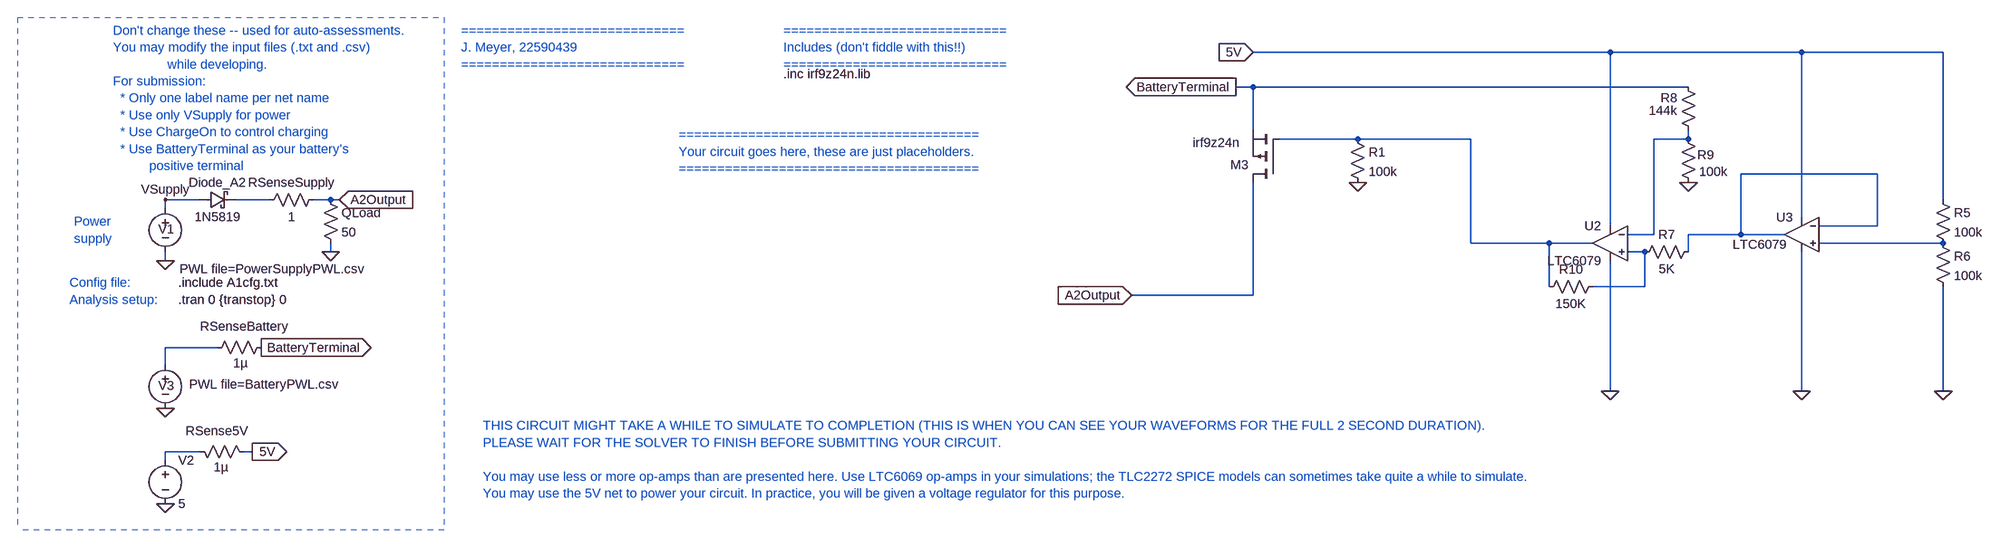
[diagram p0: schematic E344_22590439_A3.asc]
E344_22590439_A3.asc, the LTspice schematic file:
Version 4
SHEET 1 2264 680
WIRE 560 -1360 -96 -1360
WIRE 912 -1360 560 -1360
WIRE 1184 -1360 912 -1360
WIRE -96 -1296 -128 -1296
WIRE 704 -1296 -96 -1296
WIRE -96 -1216 -96 -1296
WIRE 96 -1200 -48 -1200
WIRE 304 -1200 96 -1200
WIRE 704 -1200 704 -1216
WIRE 704 -1200 640 -1200
WIRE 1056 -1136 800 -1136
WIRE -2032 -1088 -2096 -1088
WIRE -1904 -1088 -1968 -1088
WIRE -1792 -1088 -1824 -1088
WIRE -1776 -1088 -1792 -1088
WIRE 1184 -1088 1184 -1360
WIRE -2096 -1072 -2096 -1088
WIRE 912 -1056 912 -1360
WIRE 560 -1040 560 -1360
WIRE 1056 -1040 1056 -1136
WIRE 1056 -1040 944 -1040
WIRE 640 -1024 640 -1200
WIRE 640 -1024 592 -1024
WIRE 800 -1024 800 -1136
WIRE 800 -1024 704 -1024
WIRE 880 -1024 800 -1024
WIRE 304 -1008 304 -1200
WIRE 448 -1008 304 -1008
WIRE 528 -1008 448 -1008
WIRE 1184 -1008 944 -1008
WIRE -1792 -992 -1792 -1008
WIRE 624 -992 592 -992
WIRE 704 -992 704 -1024
WIRE -2096 -976 -2096 -992
WIRE 448 -928 448 -1008
WIRE 624 -928 624 -992
WIRE 624 -928 528 -928
WIRE -96 -912 -96 -1120
WIRE -96 -912 -320 -912
WIRE -2000 -816 -2096 -816
WIRE -2096 -784 -2096 -816
WIRE 560 -736 560 -976
WIRE 912 -736 912 -992
WIRE 1184 -736 1184 -928
WIRE -2032 -624 -2096 -624
WIRE -1936 -624 -1952 -624
WIRE -2096 -608 -2096 -624
FLAG -2096 -976 0
FLAG -1776 -1088 A2Output
IOPIN -1776 -1088 In
FLAG -1920 -816 BatteryTerminal
IOPIN -1920 -816 Out
FLAG -2096 -704 0
FLAG -1936 -624 5V
IOPIN -1936 -624 Out
FLAG -2096 -1088 VSupply
FLAG -1792 -992 0
FLAG -2096 -528 0
FLAG -128 -1296 BatteryTerminal
IOPIN -128 -1296 Out
FLAG -320 -912 A2Output
IOPIN -320 -912 In
FLAG -96 -1360 5V
IOPIN -96 -1360 In
FLAG 704 -1120 0
FLAG 912 -736 0
FLAG 560 -736 0
FLAG 1184 -736 0
FLAG 96 -1120 0
SYMBOL voltage -2096 -1088 R0
WINDOW 123 0 0 Left 0
WINDOW 39 0 0 Left 0
WINDOW 3 26 127 Left 2
WINDOW 0 -13 54 Left 2
SYMATTR Value PWL file=PowerSupplyPWL.csv
SYMATTR InstName V1
SYMBOL res -1904 -832 R90
WINDOW 0 -7 47 VBottom 2
WINDOW 3 29 54 VTop 2
SYMATTR InstName RSenseBattery
SYMATTR Value 1µ
SYMBOL schottky -2032 -1072 R270
WINDOW 0 32 32 VTop 2
WINDOW 3 0 32 VBottom 2
SYMATTR InstName Diode_A2
SYMATTR Value 1N5819
SYMATTR Description Diode
SYMATTR Type diode
SYMBOL voltage -2096 -800 R0
WINDOW 123 0 0 Left 0
WINDOW 39 0 0 Left 0
WINDOW 3 44 52 Left 2
WINDOW 0 -13 54 Left 2
SYMATTR Value PWL file=BatteryPWL.csv
SYMATTR InstName V3
SYMBOL res -1920 -1072 R270
WINDOW 0 32 56 VTop 2
WINDOW 3 0 56 VBottom 2
SYMATTR InstName RSenseSupply
SYMATTR Value 1
SYMBOL res -1808 -1104 R0
SYMATTR InstName QLoad
SYMATTR Value 50
SYMBOL voltage -2096 -624 R0
WINDOW 123 0 0 Left 0
WINDOW 39 0 0 Left 0
SYMATTR InstName V2
SYMATTR Value 5
SYMBOL res -2048 -640 M90
WINDOW 0 -7 47 VBottom 2
WINDOW 3 29 54 VTop 2
SYMATTR InstName RSense5V
SYMATTR Value 1µ
SYMBOL pmos -48 -1120 R180
WINDOW 3 73 73 Left 2
SYMATTR InstName M3
SYMATTR Value irf9z24n
SYMATTR Prefix X
SYMATTR SpiceModel irf9z24n
SYMBOL OpAmps\\LTC6079 560 -1008 M0
SYMATTR InstName U2
SYMBOL OpAmps\\LTC6079 912 -1024 M0
WINDOW 3 27 18 Left 2
SYMATTR InstName U3
SYMBOL res 1168 -1104 R0
SYMATTR InstName R5
SYMATTR Value 100k
SYMBOL res 1168 -1024 R0
SYMATTR InstName R6
SYMATTR Value 100k
SYMBOL res 720 -1008 R90
WINDOW 0 0 56 VBottom 2
WINDOW 3 32 56 VTop 2
SYMATTR InstName R7
SYMATTR Value 5K
SYMBOL res 720 -1200 R180
WINDOW 0 36 76 Left 2
WINDOW 3 36 52 Left 2
SYMATTR InstName R8
SYMATTR Value 144k
SYMBOL res 688 -1216 R0
WINDOW 0 32 45 Left 2
SYMATTR InstName R9
SYMATTR Value 100k
SYMBOL res 544 -944 R90
WINDOW 0 0 56 VBottom 2
WINDOW 3 32 56 VTop 2
SYMATTR InstName R10
SYMATTR Value 150K
SYMBOL res 80 -1216 R0
SYMATTR InstName R1
SYMATTR Value 100k
TEXT -2072 -904 Left 2 !.tran 0 {transtop} 0
TEXT -2072 -936 Left 2 !.include A1cfg.txt
TEXT -2192 -1400 Left 2 ;Don't change these -- used for auto-assessments.\nYou may modify the input files (.txt and .csv) \n               while developing.\nFor submission: \n  * Only one label name per net name\n  * Use only VSupply for power\n  * Use ChargeOn to control charging\n  * Use BatteryTerminal as your battery's \n          positive terminal
TEXT -2272 -936 Left 2 ;Config file:
TEXT -2272 -904 Left 2 ;Analysis setup:
TEXT -2264 -1048 Left 2 ;Power\nsupply
TEXT -1552 -1400 Left 2 ;=============================\nJ. Meyer, 22590439\n=============================
TEXT -960 -1320 Left 2 !.inc irf9z24n.lib
TEXT -960 -1400 Left 2 ;=============================\nIncludes (don't fiddle with this!!)\n=============================
TEXT -1152 -1208 Left 2 ;=======================================\nYour circuit goes here, these are just placeholders.\n=======================================
TEXT -1512 -672 Left 2 ;THIS CIRCUIT MIGHT TAKE A WHILE TO SIMULATE TO COMPLETION (THIS IS WHEN YOU CAN SEE YOUR WAVEFORMS FOR THE FULL 2 SECOND DURATION).\nPLEASE WAIT FOR THE SOLVER TO FINISH BEFORE SUBMITTING YOUR CIRCUIT.\n \nYou may use less or more op-amps than are presented here. Use LTC6069 op-amps in your simulations; the TLC2272 SPICE models can sometimes take quite a while to simulate.\nYou may use the 5V net to power your circuit. In practice, you will be given a voltage regulator for this purpose.
LINE Normal -1584 -1424 -1584 -480 2
LINE Normal -2368 -1424 -1584 -1424 2
LINE Normal -1584 -480 -2368 -480 2
LINE Normal -1584 -496 -1584 -496 2
LINE Normal -2368 -1424 -2368 -480 2

The netlist it stands for:
* E344_22590439_A3.asc
V1 VSupply 0 PWL file=PowerSupplyPWL.csv
RSenseBattery BatteryTerminal N007 1µ
Diode_A2 VSupply N004 1N5819
V3 N007 0 PWL file=BatteryPWL.csv
RSenseSupply N004 A2Output 1
R§QLoad A2Output 0 50
V2 N008 0 5
RSense5V N008 5V 1µ
XM3 A2Output N001 BatteryTerminal irf9z24n irf9z24n  ; pins D G S
XU2 N006 N002 5V 0 N001 LTC6078  ; LTC6079, pins In+ In- V+ V- OUT
XU3 N005 N003 5V 0 N003 LTC6078  ; LTC6079, pins In+ In- V+ V- OUT
R5 5V N005 100k
R6 N005 0 100k
R7 N003 N006 5K
R8 N002 BatteryTerminal 144k
R9 N002 0 100k
R10 N006 N001 150K
R1 N001 0 100k
.model D D
.lib standard.dio
.tran 0 {transtop} 0
.include A1cfg.txt
* Don't change these -- used for auto-assessments.
* You may modify the input files (.txt and .csv)
*                while developing.
* For submission:
*   * Only one label name per net name
*   * Use only VSupply for power
*   * Use ChargeOn to control charging
*   * Use BatteryTerminal as your battery's
*           positive terminal
* Config file:
* Analysis setup:
* Power
* supply
* =============================
* J. Meyer, 22590439
* =============================
.inc irf9z24n.lib
* =============================
* Includes (don't fiddle with this!!)
* =============================
* =======================================
* Your circuit goes here, these are just placeholders.
* =======================================
* THIS CIRCUIT MIGHT TAKE A WHILE TO SIMULATE TO COMPLETION (THIS IS WHEN YOU CAN SEE YOUR WAVEFORMS FOR THE FULL 2 SECOND DURATION).
* PLEASE WAIT FOR THE SOLVER TO FINISH BEFORE SUBMITTING YOUR CIRCUIT.
* You may use less or more op-amps than are presented here. Use LTC6069 op-amps in your simulations; the TLC2272 SPICE models can sometimes take quite a while to simulate.
* You may use the 5V net to power your circuit. In practice, you will be given a voltage regulator for this purpose.
.lib LTC5.lib
.backanno
.end

* Results of the author's LTspice run, read from the files saved beside the schematic
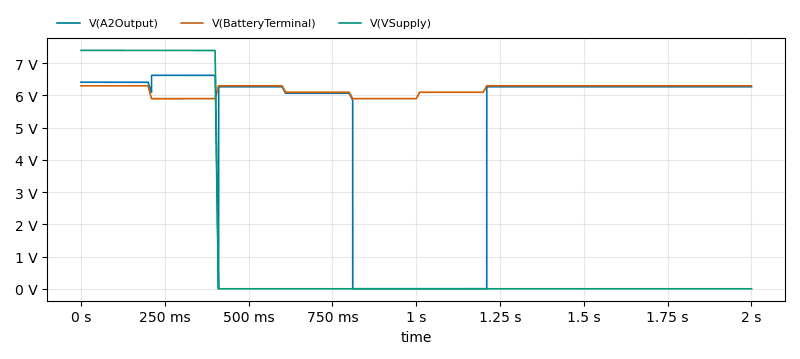
[diagram p1: Transient Analysis of E344_22590439_A3.asc, plotted from the saved traces]
* Transient Analysis, 1 run:
*   V(A2Output): min -479.5 µV, max 6.626 V, average 5.027 V, rms 5.628 V, last 6.27 V
*   V(BatteryTerminal): min 5.9 V, max 6.3 V, average 6.18 V, rms 6.182 V, last 6.3 V
*   V(VSupply): min 0 V, max 7.4 V, average 1.499 V, rms 3.323 V, last 0 V